# EAGLE design Relay-Timer (EAGLE 6.3)

## Sheet 1 of 5
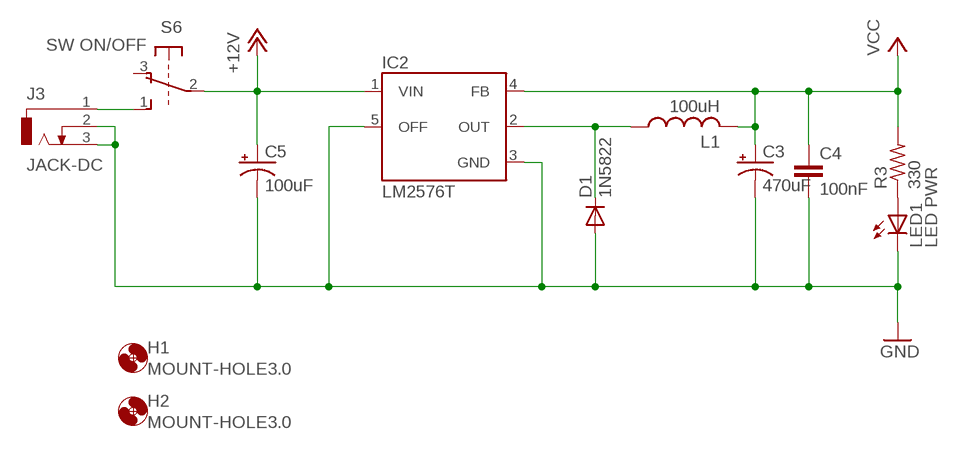
[diagram p0: schematic, sheet 1]

### Parts
C3  470uF  CAPACITOR-POLARE3.5-8  [E3,5-8]
C4  100nF  CAPACITOR-NONPOLAR025-024X044  [C025-024X044]
C5  100uF  CAPACITOR-POLARE2.5-6  [E2,5-6]
D1  1N5822  DIODE-1N5822  [DO201-15]
H1  MOUNT-HOLE3.0  [3,0]
H2  MOUNT-HOLE3.0  [3,0]
IC2  LM2576T  [TO220-5]
J3  JACK-DC  [DCJ0202]
L1  100uH  INDUCTORTJ3-U2  [TJ3-U2]
LED1  LED PWR  LED3MM  [LED3MM]
R3  330  RESISTOR0204/7  [0204/7]
S6  SW ON/OFF  SWITCH-DETENT  [9077-2]

### Nets
+12V [pwr]: C5.+ IC2.1(VIN) S6.2(P) ; also sheet 4
GND [vcc]: C3.- C4.2 C5.- D1.A IC2.3(GND) IC2.5(OFF) J3.2 J3.3 LED1.K(C) ; also sheet 2,3,4,5
N$5: D1.C IC2.2(OUT) L1.1
N$6: LED1.A R3.1
N$37 [pwr]: J3.1 S6.1(S)
VCC [vcc]: C3.+ C4.1 IC2.4(FB) L1.2 R3.2 ; also sheet 2,5
Unconnected: S6.3(O)

## Sheet 2 of 5
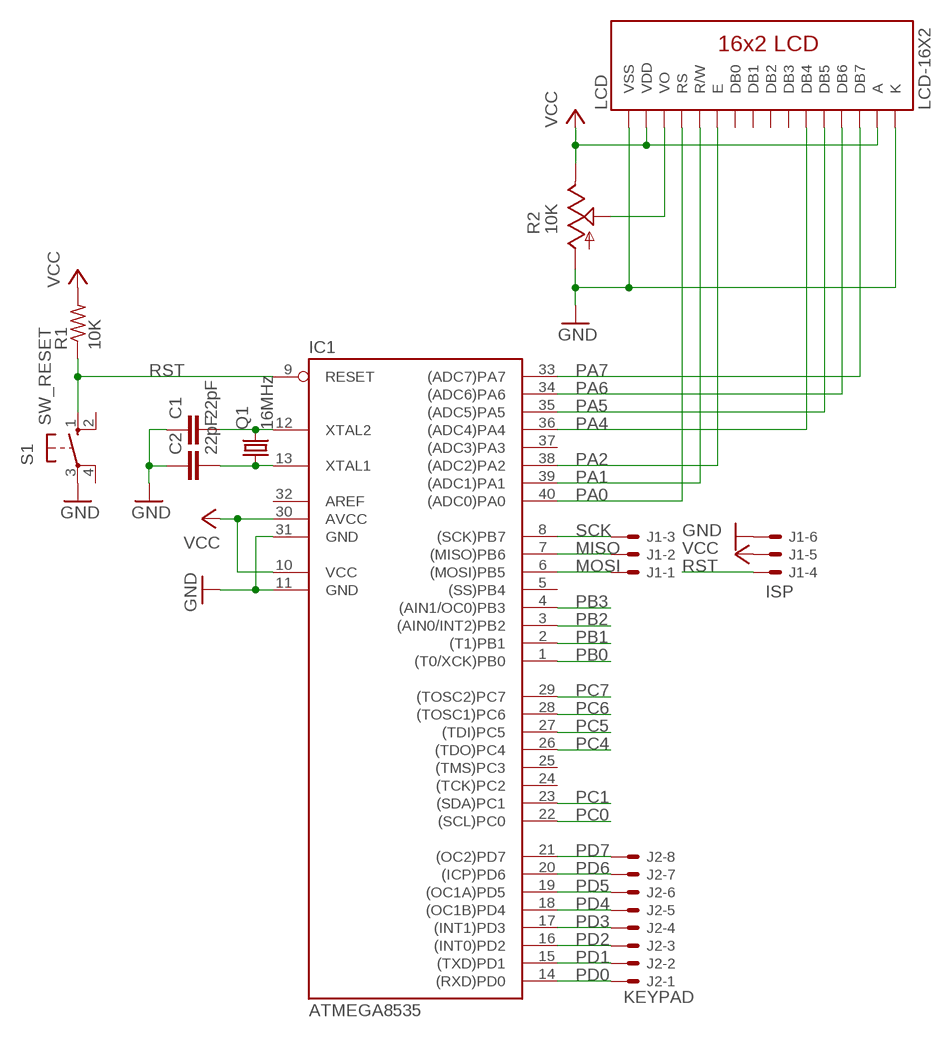
[diagram p1: schematic, sheet 2]

### Parts
C1  22pF  CAPACITOR-NONPOLAR025-024X044  [C025-024X044]
C2  22pF  CAPACITOR-NONPOLAR025-024X044  [C025-024X044]
IC1  ATMEGA8535  ATMEGA8535/16/32  [DIL40]
J1  ISP  CON_MOLEX-27-2061-06  [6410-06]
J2  KEYPAD  CON_MOLEX-27-2081-08  [6410-08]
LCD  LCD-16X2  [LCD-16X2]
Q1  16MHz  CRYSTALHC49S  [HC49/S]
R1  10K  RESISTOR0204/7  [0204/7]
R2  10K  TRIMPOTCA6V  [CA6V]
S1  SW_RESET  SW-PUSHBUTTON  [B3F-10XX]

### Nets
GND [vcc]: C1.1 C2.1 IC1.11(GND) IC1.31(GND) J1.6 LCD.1(VSS) LCD.16(K) R2.A S1.3(P) ; also sheet 1,3,4,5
MISO: IC1.7((MISO)PB6) J1.2
MOSI: IC1.6((MOSI)PB5) J1.1
N$2: C1.2 IC1.12(XTAL2) Q1.2
N$3: C2.2 IC1.13(XTAL1) Q1.1
N$4: LCD.3(VO) R2.S
PA0: IC1.40((ADC0)PA0) LCD.4(RS)
PA1: IC1.39((ADC1)PA1) LCD.5(R/W)
PA2: IC1.38((ADC2)PA2) LCD.6(E)
PA4: IC1.36((ADC4)PA4) LCD.11(DB4)
PA5: IC1.35((ADC5)PA5) LCD.12(DB5)
PA6: IC1.34((ADC6)PA6) LCD.13(DB6)
PA7: IC1.33((ADC7)PA7) LCD.14(DB7)
PB0: IC1.1((T0/XCK)PB0) ; also sheet 3
PB1: IC1.2((T1)PB1) ; also sheet 3
PB2: IC1.3((AIN0/INT2)PB2) ; also sheet 3
PB3: IC1.4((AIN1/OC0)PB3) ; also sheet 3
PC0: IC1.22((SCL)PC0) ; also sheet 5
PC1: IC1.23((SDA)PC1) ; also sheet 5
PC4: IC1.26((TDO)PC4) ; also sheet 4
PC5: IC1.27((TDI)PC5) ; also sheet 4
PC6: IC1.28((TOSC1)PC6) ; also sheet 4
PC7: IC1.29((TOSC2)PC7) ; also sheet 4
PD0: IC1.14((RXD)PD0) J2.1
PD1: IC1.15((TXD)PD1) J2.2
PD2: IC1.16((INT0)PD2) J2.3
PD3: IC1.17((INT1)PD3) J2.4
PD4: IC1.18((OC1B)PD4) J2.5
PD5: IC1.19((OC1A)PD5) J2.6
PD6: IC1.20((ICP)PD6) J2.7
PD7: IC1.21((OC2)PD7) J2.8
RST: IC1.9(RESET) J1.4 R1.1 S1.1(S)
SCK: IC1.8((SCK)PB7) J1.3
VCC [vcc]: IC1.10(VCC) IC1.30(AVCC) J1.5 LCD.2(VDD) LCD.15(A) R1.2 R2.E ; also sheet 1,5
Unconnected: IC1.5((SS)PB4) IC1.24((TCK)PC2) IC1.25((TMS)PC3) IC1.32(AREF) IC1.37((ADC3)PA3) LCD.7(DB0) LCD.8(DB1) LCD.9(DB2) LCD.10(DB3) S1.2(S1) S1.4(P1)

## Sheet 3 of 5
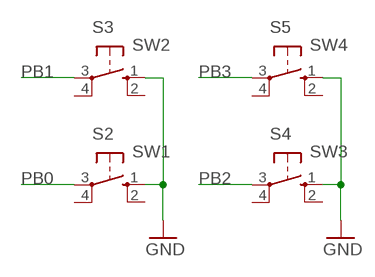
[diagram p2: schematic, sheet 3]

### Parts
S2  SW1  SW-PUSHBUTTON  [B3F-10XX]
S3  SW2  SW-PUSHBUTTON  [B3F-10XX]
S4  SW3  SW-PUSHBUTTON  [B3F-10XX]
S5  SW4  SW-PUSHBUTTON  [B3F-10XX]

### Nets
GND [vcc]: S2.1(S) S3.1(S) S4.1(S) S5.1(S) ; also sheet 1,2,4,5
PB0: S2.3(P) ; also sheet 2
PB1: S3.3(P) ; also sheet 2
PB2: S4.3(P) ; also sheet 2
PB3: S5.3(P) ; also sheet 2
Unconnected: S2.2(S1) S2.4(P1) S3.2(S1) S3.4(P1) S4.2(S1) S4.4(P1) S5.2(S1) S5.4(P1)

## Sheet 4 of 5
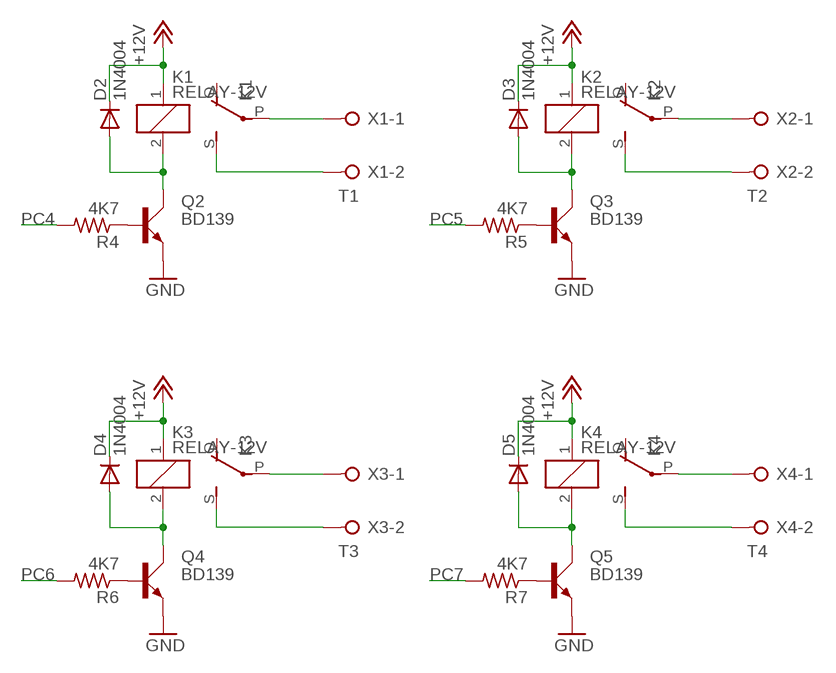
[diagram p3: schematic, sheet 4]

### Parts
D2  1N4004  DIODE-1N4004  [DO41-10]
D3  1N4004  DIODE-1N4004  [DO41-10]
D4  1N4004  DIODE-1N4004  [DO41-10]
D5  1N4004  DIODE-1N4004  [DO41-10]
K1  RELAY-12V  G5L  [G5LE]
K2  RELAY-12V  G5L  [G5LE]
K3  RELAY-12V  G5L  [G5LE]
K4  RELAY-12V  G5L  [G5LE]
Q2  BD139  [TO126AV]
Q3  BD139  [TO126AV]
Q4  BD139  [TO126AV]
Q5  BD139  [TO126AV]
R4  4K7  RESISTOR0204/7  [0204/7]
R5  4K7  RESISTOR0204/7  [0204/7]
R6  4K7  RESISTOR0204/7  [0204/7]
R7  4K7  RESISTOR0204/7  [0204/7]
X1  T1  W237-02P  [W237-132]
X2  T2  W237-02P  [W237-132]
X3  T3  W237-02P  [W237-132]
X4  T4  W237-02P  [W237-132]

### Nets
+12V [pwr]: D2.C D3.C D4.C D5.C K1.1 K2.1 K3.1 K4.1 ; also sheet 1
GND [vcc]: Q2.E Q3.E Q4.E Q5.E ; also sheet 1,2,3,5
N$1: D2.A K1.2 Q2.C
N$7: Q2.B R4.1
N$10 [pwr]: K1.P(2:P) X1.1
N$11 [pwr]: K1.S(2:S) X1.2
N$12: D3.A K2.2 Q3.C
N$13: Q3.B R5.1
N$14 [pwr]: K2.P(2:P) X2.1
N$15 [pwr]: K2.S(2:S) X2.2
N$16: D4.A K3.2 Q4.C
N$17: Q4.B R6.1
N$18 [pwr]: K3.P(2:P) X3.1
N$19 [pwr]: K3.S(2:S) X3.2
N$20: D5.A K4.2 Q5.C
N$21: Q5.B R7.1
N$25 [pwr]: K4.P(2:P) X4.1
N$26 [pwr]: K4.S(2:S) X4.2
PC4: R4.2 ; also sheet 2
PC5: R5.2 ; also sheet 2
PC6: R6.2 ; also sheet 2
PC7: R7.2 ; also sheet 2
Unconnected: K1.O(2:O) K2.O(2:O) K3.O(2:O) K4.O(2:O)

## Sheet 5 of 5
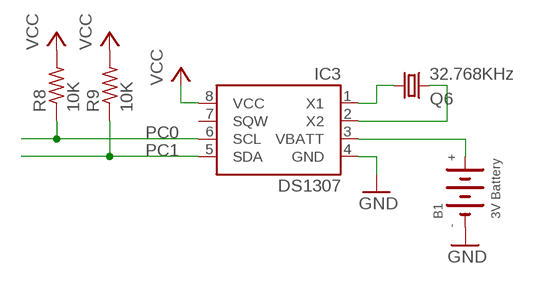
[diagram p4: schematic, sheet 5]

### Parts
B1  3V Battery  BATTERYCR2032  [CR2032]
IC3  DS1307  [DIP08]
Q6  32.768KHz  CRYSTALTC26H  [TC26H]
R8  10K  RESISTOR0204/7  [0204/7]
R9  10K  RESISTOR0204/7  [0204/7]

### Nets
GND [vcc]: B1.- IC3.4(GND) ; also sheet 1,2,3,4
N$29: IC3.1(X1) Q6.1
N$30: IC3.2(X2) Q6.2
N$31: B1.+ IC3.3(VBATT)
PC0: IC3.6(SCL) R8.1 ; also sheet 2
PC1: IC3.5(SDA) R9.1 ; also sheet 2
VCC [vcc]: IC3.8(VCC) R8.2 R9.2 ; also sheet 1,2
Unconnected: IC3.7(SQW)

## Library data of the parts
B1 = microbuilder:BATTERY
C1 C2 C4 = barelang-store:CAPACITOR-NONPOLAR: CAPACITOR, European symbol
C3 C5 = barelang-store:CAPACITOR-POLAR: POLARIZED CAPACITOR, American symbol
D1 = barelang-store:DIODE-1N5822: DIODE standard rectifier, 3 A, 50 V (Motorola)
D2-D5 = barelang-store:DIODE-1N4004: DIODE general purpose rectifier, 1 A
H1 H2 = holes:MOUNT-HOLE: MOUNTING HOLE with drill center marker
IC1 = barelang-store:ATMEGA8535/16/32: MICROCONTROLLER 32 Kbytes FLASH 2 Kbytes SRAM 1 Kbytes EEPROM USART 8-channel 10 bit ADC Source: www.atmel.com .. doc2503.pdf; MPN: ATMEGA32-16PU; OC_FARNELL: 1661729; OC_NEWARK: 51P1794
IC2 = barelang-store:LM2576: National Semiconductor <http://www.national.com> 3.0A "Simple Switcher"(c) 52kHz, Vout 1.23-37V (HV: 57V), Vin 40V (HV: 60V), 50µA standby current
IC3 = barelang-store:DS1307
J1 = barelang-store:CON_MOLEX-?-06: CONNECTOR wire to board 2.54 mm (.1 inch) pitch header; OC_FARNELL: unknown; OC_NEWARK: unknown
J2 = barelang-store:CON_MOLEX-?-08: CONNECTOR wire to board 2.54 mm (.1 inch) pitch header; OC_FARNELL: unknown; OC_NEWARK: unknown
J3 = barelang-store:JACK-DC: DC POWER JACK Source: DCJ0202.pdf; OC_FARNELL: unknown; OC_NEWARK: unknown
K1-K4 = relay:G5L: RELAY 1 x switch, 10 A/120 V AC, 8 A/30 V ADC, Omron; OC_FARNELL: unknown; OC_NEWARK: unknown
L1 = barelang-store:INDUCTOR: INDUCTOR, American symbol
LCD = barelang-store:LCD-16X2
LED1 = barelang-store:LED: LED OSRAM: - CHIPLED LG R971, LG N971, LY N971, LG Q971, LY Q971, LO R971, LY R971 LH N974, LH R974 LS Q976, LO Q976, LY Q976 LO Q996 - Hyper CHIPLED LW Q18S LB Q993, LB Q99A, LB R99A - SideLED LS A670, LO A670, LY A670, LG A670, LP A670 LB A673, LV A673, LT A673, LW A673 LH A674 LY A675 LS A676, LA A676, LO A676, LY A676, LW A676 LS A679, LY A679, LG A679 - Hyper Micro SIDELED® LS Y876, LA Y876, LO Y876, LY Y876 LT Y87S - SmartLED LW L88C, LW L88S LB L89C, LB L89S, LG L890 LS L89K, LO L89K, LY L89K LS L896, LA L896, LO L896, LY L896 - TOPLED LS T670, LO T670, LY T670, LG T670, LP T670 LSG T670, LSP T670, LSY T670, LOP T670, LYG T670 LG T671, LOG T671, LSG T671 LB T673, LV T673, LT T673, LW T673 LH T674 LS T676, LA T676, LO T676, LY T676, LB T676, LH T676, LSB T676, LW T676 LB T67C, LV T67C, LT T67C, LS T67K, LO T67K, LY T67K, LW E67C LS E67B, LA E67B, LO E67B, LY E67B, LB E67C, LV E67C, LT E67C LW T67C LS T679, LY T679, LG T679 LS T770, LO T770, LY T770, LG T770, LP T770 LB T773, LV T773, LT T773, LW T773 LH T774 LS E675, LA E675, LY E675, LS T675 LS T776, LA T776, LO T776, LY T776, LB T776 LHGB T686 LT T68C, LB T68C - Hyper Mini TOPLED® LB M676 - Mini TOPLED Santana® LG M470 LS M47K, LO M47K, LY M47K Source: http://www.osram.convergy.de LUXEON: - LUMILED® LXK2-PW12-R00, LXK2-PW12-S00, LXK2-PW14-U00, LXK2-PW14-V00 LXK2-PM12-R00, LXK2-PM12-S00, LXK2-PM14-U00 LXK2-PE12-Q00, LXK2-PE12-R00, LXK2-PE12-S00, LXK2-PE14-T00, LXK2-PE14-U00 LXK2-PB12-K00, LXK2-PB12-L00, LXK2-PB12-M00, LXK2-PB14-N00, LXK2-PB14-P00, LXK2-PB14-Q00 LXK2-PR12-L00, LXK2-PR12-M00, LXK2-PR14-Q00, LXK2-PR14-R00 LXK2-PD12-Q00, LXK2-PD12-R00, LXK2-PD12-S00 LXK2-PH12-R00, LXK2-PH12-S00 LXK2-PL12-P00, LXK2-PL12-Q00, LXK2-PL12-R00 Source: www.luxeon.com KINGBRIGHT: KA-3528ASYC Source: www.kingbright.com
Q1 = barelang-store:CRYSTAL: CRYSTAL; OC_FARNELL: 1667008; OC_NEWARK: unknown
Q2-Q5 = barelang-store:BD139: NPN TRANSISTOR
Q6 = crystal:CRYSTAL: CRYSTAL; OC_FARNELL: unknown; OC_NEWARK: unknown
R1 R3-R9 = barelang-store:RESISTOR: RESISTOR, American symbol
R2 = barelang-store:TRIMPOT: POTENTIOMETER
S1-S5 = barelang-store:SW-PUSHBUTTON: OMRON SWITCH; MPN: B3F-1000; OC_FARNELL: 176432; OC_NEWARK: 36M3542
S6 = barelang-store:SWITCH-DETENT: MARQUARDT SWITCH 9077.0200 Distributor: Buerklin <https://www.buerklin.com/default.asp?event=ShowArtikel%2812G2822%29&l=d&jump=ArtNr_12G2822>
X1-X4 = barelang-store:W237-02P: WAGO SREW CLAMP; OC_FARNELL: unknown; OC_NEWARK: unknown

## Net classes
0 default: width 0.4 mm
1 pwr: width 0.7 mm
2 vcc: width 0.5 mm

## Board
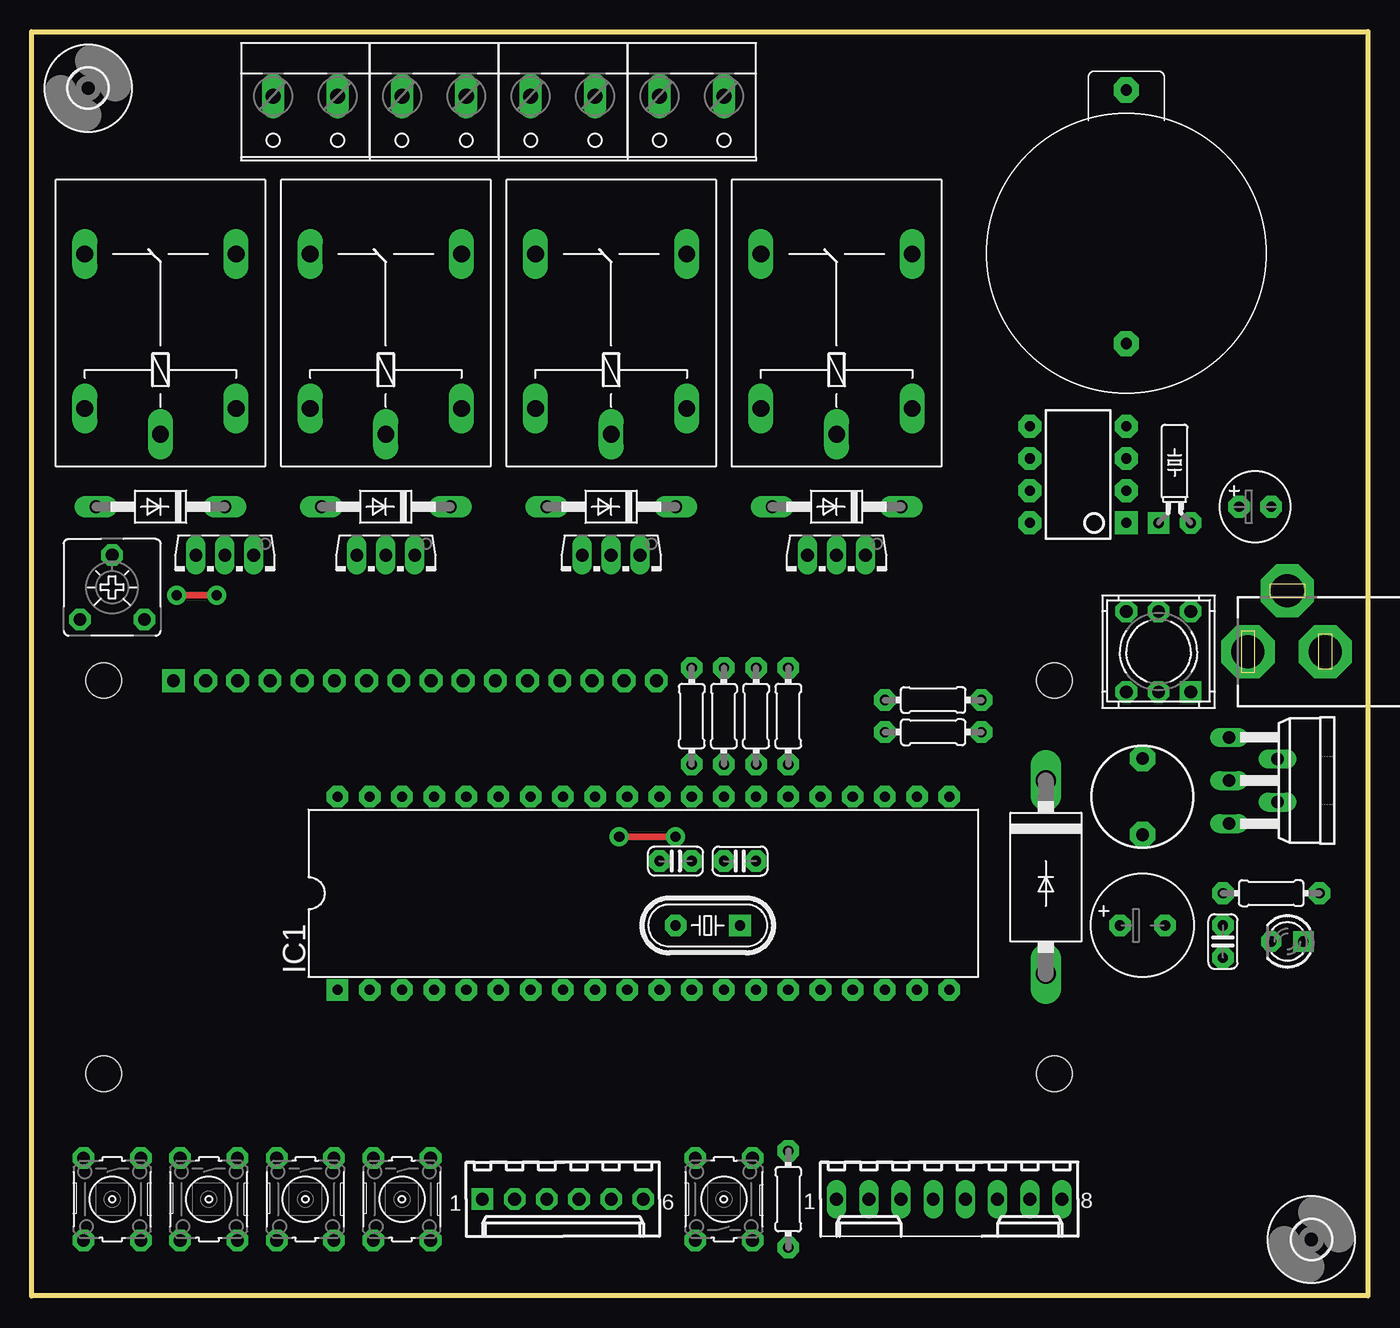
[diagram p5: board, top side]
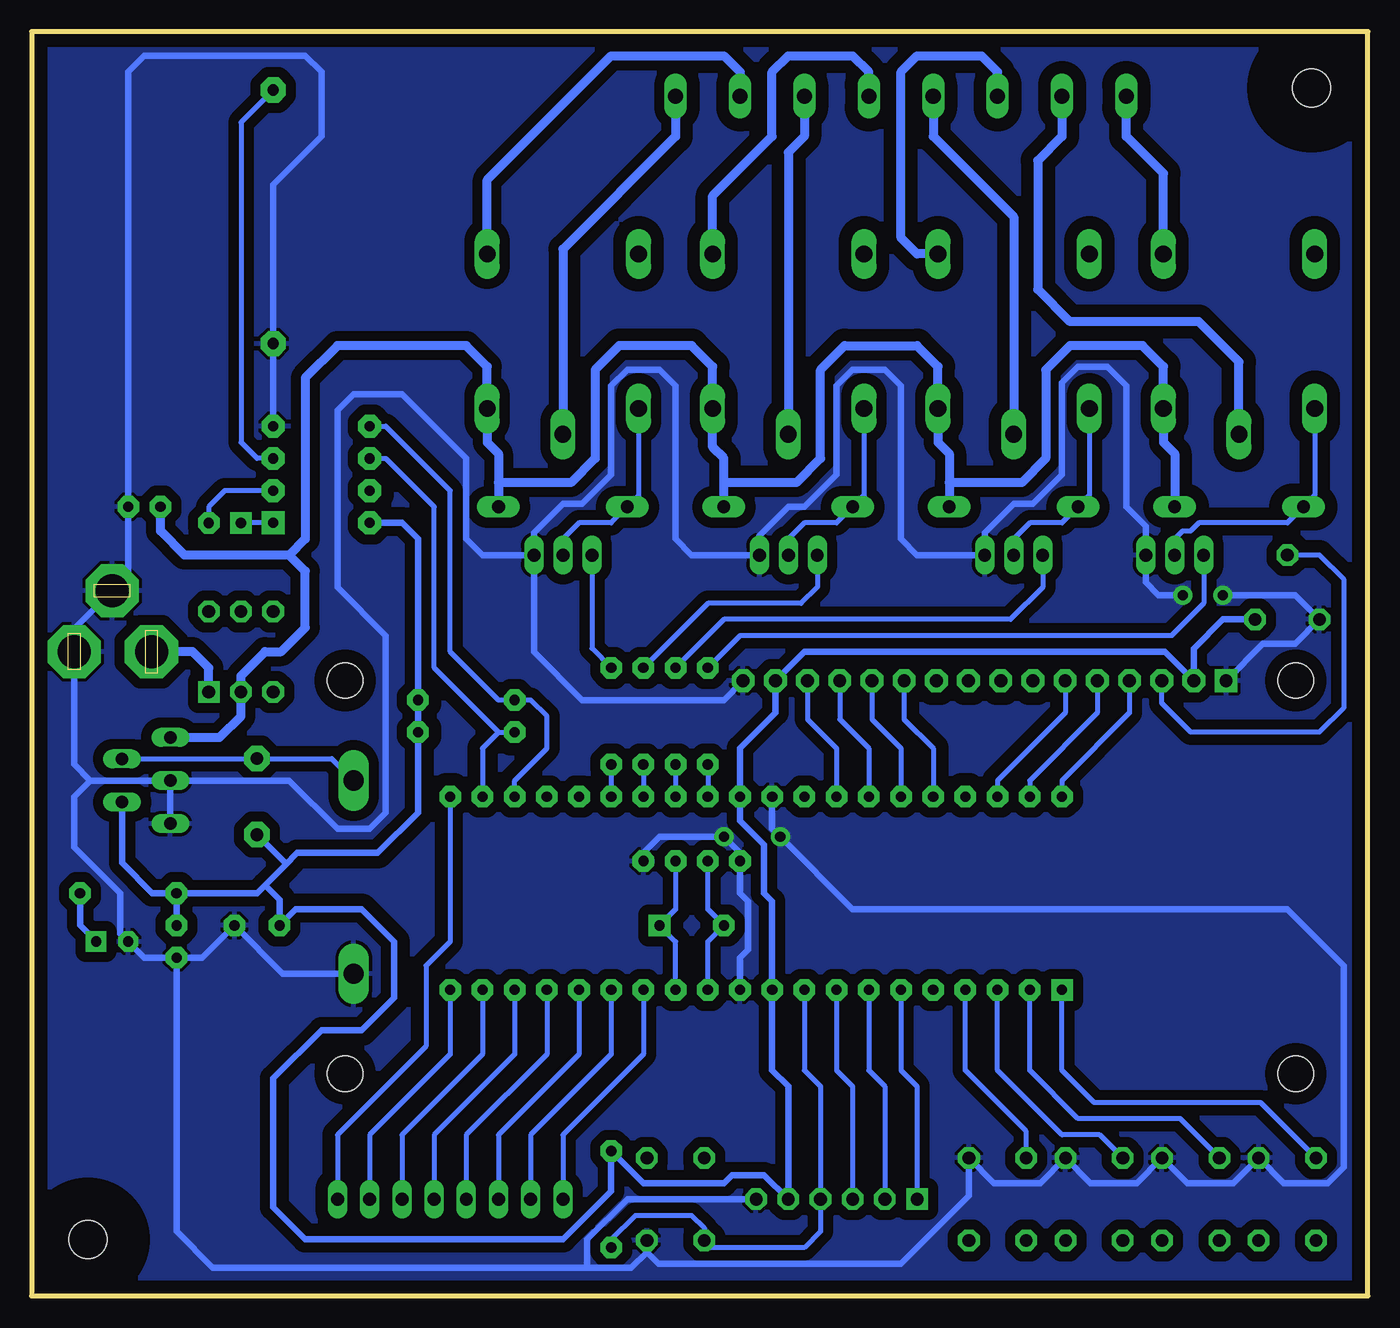
[diagram p6: board, bottom side, seen from below]

Size 105.41 x 99.69 mm. Coordinates in mm from the lower left corner, seen from the top.
Outline: 0,99.69 105.41,99.69 105.41,0 0,0 0,99.69
Copper layers (1*16): Top 0.035mm / dielectric 1.5mm / Bottom 0.035mm
Design rules "default": minimum track width 10mil, minimum drill 24mil, track to track 8mil, track to pad 8mil, pad to pad 8mil, via to via 8mil, smd to smd 8mil, copper to edge 40mil, drill to drill 8mil, minimum pad ring 10mil, minimum via ring 8mil, stop-mask expansion 4mil, vias tented up to drill 0mil, thermal gap 10mil

### Footprints (pad centres in the part's own frame; a part is rotated, then mirrored left to right if it is on the bottom)
CR2032 = drill 0.9 pad 2 octagon: + 10,0; - -10,0
C025-024X044 = drill 0.8 pad 1.7 octagon: 1 -1.27,0; 2 1.27,0
E3,5-8 = drill 0.813 pad 1.7 octagon: + -1.778,0; - 1.778,0
E2,5-6 = drill 0.8 pad 1.7 octagon: + -1.27,0; - 1.27,0
DO201-15 = drill 1.6 long: A 7.62,0; C -7.62,0
DO41-10 = drill 1 pad 1.7 long: A 5.08,0; C -5.08,0
3,0 = hole 3: 0,0
DIL40 = drill 0.8 pad 1.7 square: 1 -24.13,-7.62 | drill 0.8 pad 1.7 octagon: 2 -21.59,-7.62; 3 -19.05,-7.62; 4 -16.51,-7.62; 5 -13.97,-7.62; 6 -11.43,-7.62; 7 -8.89,-7.62; 8 -6.35,-7.62; 9 -3.81,-7.62; 10 -1.27,-7.62; 11 1.27,-7.62; 12 3.81,-7.62; 13 6.35,-7.62; 14 8.89,-7.62; 15 11.43,-7.62; 16 13.97,-7.62; 17 16.51,-7.62; 18 19.05,-7.62; 19 21.59,-7.62; 20 24.13,-7.62; 21 24.13,7.62; 22 21.59,7.62; 23 19.05,7.62; 24 16.51,7.62; 25 13.97,7.62; 26 11.43,7.62; 27 8.89,7.62; 28 6.35,7.62; 29 3.81,7.62; 30 1.27,7.62; 31 -1.27,7.62; 32 -3.81,7.62; 33 -6.35,7.62; 34 -8.89,7.62; 35 -11.43,7.62; 36 -13.97,7.62; 37 -16.51,7.62; 38 -19.05,7.62; 39 -21.59,7.62; 40 -24.13,7.62
TO220-5 = drill 1 long: 1 -3.4,-8.4; 2 -1.7,-4.59; 3 0,-8.4; 4 1.7,-4.59; 5 3.4,-8.4
DIP08 = drill 0.8 pad 1.8 square: 1 -3.81,-3.81 | drill 0.8 pad 1.8 octagon: 2 -1.27,-3.81; 3 1.27,-3.81; 4 3.81,-3.81; 5 3.81,3.81; 6 1.27,3.81; 7 -1.27,3.81; 8 -3.81,3.81
6410-06 = drill 1 pad 1.7 square: 1 6.35,0 | drill 1 pad 1.7 octagon: 2 3.81,0; 3 1.27,0; 4 -1.27,0; 5 -3.81,0; 6 -6.35,0
6410-08 = drill 1.016 long: 1 8.89,0; 2 6.35,0; 3 3.81,0; 4 1.27,0; 5 -1.27,0; 6 -3.81,0; 7 -6.35,0; 8 -8.89,0
DCJ0202 = drill 2.6 pad 4.2 octagon: 1 0,3.1; 2 4.8,0; 3 0,-3
G5LE = drill 1.321 long: 1 -7.493,-5.969; 2 -7.493,5.969; O 4.699,5.969; P -9.525,0; S 4.699,-5.969
TJ3-U2 = drill 1 pad 2 octagon: 1 -3,0; 2 3,0
LCD-16X2 = drill 1.016 pad 1.8 square: 1 -32,15.5 | drill 1.016 pad 1.8 octagon: 2 -29.46,15.5; 3 -26.92,15.5; 4 -24.38,15.5; 5 -21.84,15.5; 6 -19.3,15.5; 7 -16.76,15.5; 8 -14.22,15.5; 9 -11.68,15.5; 10 -9.14,15.5; 11 -6.6,15.5; 12 -4.06,15.5; 13 -1.52,15.5; 14 1.02,15.5; 15 3.56,15.5; 16 6.1,15.5 | hole 2.8: -37.5,15.5; -37.5,-15.5; 37.5,15.5; 37.5,-15.5
LED3MM = drill 0.8 pad 1.6 square: A -1.27,0 | drill 0.8 pad 1.6 octagon: K 1.27,0
HC49/S = drill 0.8 pad 1.7 square: 1 -2.54,0 | drill 0.8 pad 1.7 octagon: 2 2.54,0
TO126AV = drill 1.016 long: B 2.286,-1.27; C 0,-1.27; E -2.286,-1.27
TC26H = drill 0.813 pad 1.7 square: 1 -1.27,0 | drill 0.813 pad 1.7 octagon: 2 1.27,0
0204/7 = drill 0.813 pad 1.7 octagon: 1 -3.81,0; 2 3.81,0
CA6V = drill 1 pad 1.7 octagon: A -2.54,-2.54; E 2.54,-2.54; S 0,2.54
B3F-10XX = drill 1 pad 1.7 octagon: 1 -3.251,2.261; 2 3.251,2.261; 3 -3.251,-2.261; 4 3.251,-2.261
9077-2 = drill 1 pad 1.7 square: 1 -2.54,3.175 | drill 1 pad 1.7 octagon: 2 0,3.175; 3 2.54,3.175; 4 -2.54,-3.175; 5 0,-3.175; 6 2.54,-3.175
W237-132 = drill 1.194 long: 1 -2.54,-0.635; 2 2.54,-0.635

### Placement (x,y rotation side)
B1  86.36,85.09 90 top
C1  50.8,34.29 0 top
C2  55.88,34.29 180 top
C3  87.63,29.21 0 top
C4  93.98,27.94 270 top
C5  96.52,62.23 0 top
D1  80.01,33.02 270 top
D2  63.5,62.23 180 top
D3  45.72,62.23 180 top
D4  27.94,62.23 180 top
D5  10.16,62.23 180 top
H1  4.45,95.25 0 top
H2  100.97,4.44 0 top
IC1  48.26,31.75 0 top
IC2  102.87,40.64 270 top
IC3  82.55,64.77 90 top
J1  41.91,7.62 180 top
J2  72.39,7.62 180 top
J3  99.06,50.8 90 top
K1  63.5,77.47 90 top
K2  45.72,77.47 90 top
K3  27.94,77.47 90 top
K4  10.16,77.47 90 top
L1  87.63,39.37 270 top
LCD  43.18,33.02 0 top
LED1  99.06,27.94 180 top
Q1  53.34,29.21 180 top
Q2  63.5,57.15 180 top
Q3  45.72,57.15 180 top
Q4  27.94,57.15 180 top
Q5  15.24,57.15 180 top
Q6  90.17,60.96 0 top
R1  59.69,7.62 90 top
R2  6.35,55.88 0 top
R3  97.79,31.75 180 top
R4  59.69,45.72 270 top
R5  57.15,45.72 270 top
R6  54.61,45.72 270 top
R7  52.07,45.72 270 top
R8  71.12,44.45 0 top
R9  71.12,46.99 0 top
S1  54.61,7.62 90 top
S2  6.35,7.62 270 top
S3  13.97,7.62 270 top
S4  21.59,7.62 270 top
S5  29.21,7.62 270 top
S6  88.9,50.8 180 top
X1  52.07,93.98 180 top
X2  41.91,93.98 180 top
X3  31.75,93.98 180 top
X4  21.59,93.98 180 top

### Tracks (layer width: path | path; a pad name or v marks a point on that pad's centre or on a via)
+12V
  Bottom 0.7: 68.58,64.14 62.86,64.14 60.96,66.04 60.96,73.02 59.05,74.93 53.34,74.93 51.69,73.28 K2.1 51.69,66.93 50.8,66.04 50.8,64.14 | 68.58,64.14 68.58,66.42 69.47,67.31 K1.1 69.47,73.28 71.12,74.93 81.28,74.93 83.82,72.39 83.82,59.69 85.09,58.42 | 33.02,64.14 27.31,64.14 25.4,66.04 25.4,73.02 23.5,74.93 17.78,74.93 16.13,73.28 K4.1 16.13,67.31 15.24,66.42 D5.C | 33.02,64.14 33.02,66.42 33.91,67.31 K3.1 33.91,73.28 35.56,74.93 41.28,74.93 43.18,73.02 43.18,66.04 45.08,64.14 50.8,64.14 | 33.02,64.14 D4.C | 85.09,58.42 83.82,57.15 83.82,52.7 85.72,50.8 86.99,50.8 88.9,48.89 S6.2 88.9,45.72 90.58,44.04 IC2.1 | 85.09,58.42 93.34,58.42 95.25,60.33 C5.+ | 68.58,64.14 D2.C | D3.C 50.8,64.14
GND  (via drill 0.8 pad 1.5)
  Top 0.5: v50.8,36.2 v46.35,36.2 | v14.61,55.25 v11.43,55.25
  Bottom 0.5: IC2.3 85.09,40.64 81.28,36.83 78.74,36.83 77.47,38.1 77.47,52.07 81.28,55.88 81.28,69.85 80.01,71.12 76.2,71.12 71.12,66.04 71.12,59.69 69.85,58.42 Q2.E | LCD.16 50.81,46.99 61.98,46.99 65.79,50.8 Q2.E | C4.2 93.98,5.08 91.12,2.22 61.59,2.22 | J1.6 58.42,7.62 61.59,4.44 61.59,2.22 | LCD.1 8.27,51.44 5.71,51.44 R2.A 5.71,55.25 v11.43,55.25 | C4.2 91.95,26.67 C3.- 85.6,25.4 D1.A | C4.2 96.52,26.67 LED1.K 98.42,28.57 98.42,31.75 102.06,35.38 102.06,39.37 100.79,40.64 | IC1.11 49.53,26.67 48.89,27.3 48.89,31.11 49.53,31.75 C1.1 49.53,34.92 v50.8,36.2 55.88,36.2 57.15,34.92 C2.1 | IC3.4 B1.- 86.36,87.63 82.55,91.44 82.55,96.52 83.82,97.79 96.52,97.79 97.79,96.52 C5.- 97.79,56.87 J3.2 102.06,52.6 J3.3 102.06,41.91 100.79,40.64 | Q2.E 65.79,60.19 63.5,62.48 61.98,62.48 59.69,64.77 59.69,71.75 58.42,73.02 55.88,73.02 54.61,71.75 54.61,59.69 53.34,58.42 Q3.E 48.01,59.94 45.72,62.23 44.45,62.23 41.91,64.77 41.91,71.75 40.64,73.02 38.1,73.02 36.83,71.75 36.83,59.69 35.56,58.42 Q4.E 30.23,60.19 27.94,62.48 26.42,62.48 24.13,64.77 24.13,72 22.86,73.27 20.56,73.27 19.05,71.75 19.05,62.23 17.53,60.71 Q5.E 17.53,56.26 16.51,55.25 v14.61,55.25 | 56.87,3.45 58.11,2.22 61.59,2.22 | 56.87,3.45 S1.3 | 56.87,3.45 55.96,2.54 36.83,2.54 31.47,7.9 S5.1 29.49,8.89 25.83,8.89 S4.1 21.87,8.89 18.21,8.89 S3.1 14.25,8.89 10.59,8.89 S2.1 6.63,8.89 3.18,8.89 1.91,10.16 1.91,26.03 6.35,30.48 40.64,30.48 v46.35,36.2 46.99,36.83 IC1.31 | IC2.5 IC2.3 | IC2.3 100.79,40.64
  pour Bottom (isolate 0.8): 0,99.69 105.41,99.69 105.41,0 0,0
MISO
  Bottom 0.4: IC1.7 39.37,17.78 38.1,16.51 J1.2
MOSI
  Bottom 0.4: IC1.6 36.83,17.78 35.56,16.51 J1.1
N$1
  Bottom 0.4: K1.2 57.53,63.12 D2.A 59.69,60.96 62.23,60.96 63.5,59.69 Q2.C
N$2
  Bottom 0.4: C1.2 52.07,30.48 Q1.2 52.07,27.94 IC1.12
N$3
  Bottom 0.4: C2.2 54.61,30.48 Q1.1 54.61,27.94 IC1.13
N$4
  Bottom 0.4: LCD.3 16.26,46.74 13.97,44.45 3.81,44.45 1.91,46.36 1.91,56.52 3.81,58.42 R2.S
N$5
  Bottom 0.4: IC2.2 87.66,42.34 L1.1 81.74,42.37 D1.C
N$6
  Bottom 0.5: LED1.A 101.6,29.21 R3.1
N$7
  Bottom 0.4: Q2.B 61.21,51.05 R4.1
N$8
  pour Bottom (isolate 1): 0,99.69 105.41,99.69 105.41,0 0,0
N$10
  Bottom 0.7: X1.1 54.61,91.44 63.5,82.55 K1.P
N$11
  Bottom 0.7: K1.S 69.47,88.01 59.69,97.79 50.8,97.79 49.53,96.52 X1.2
N$12
  Bottom 0.4: K2.2 39.75,63.12 D3.A 41.91,60.96 44.45,60.96 45.72,59.69 Q3.C
N$13
  Bottom 0.4: Q3.B 43.43,55.88 44.7,54.61 52.07,54.61 R5.1
N$14
  Bottom 0.7: X2.1 44.45,91.44 45.72,90.17 K2.P
N$15
  Bottom 0.7: K2.S 51.69,86.74 46.99,91.44 46.99,96.52 45.72,97.79 40.64,97.79 39.37,96.52 X2.2
N$16
  Bottom 0.4: K3.2 21.97,63.12 D4.A 24.13,60.96 26.67,60.96 27.94,59.69 Q4.C
N$17
  Bottom 0.4: Q4.B 25.65,55.88 28.19,53.34 50.8,53.34 R6.1
N$18
  Bottom 0.7: X3.1 34.29,91.44 27.94,85.09 K3.P
N$19
  Bottom 0.7: K3.S 35.56,82.17 36.83,83.44 36.83,96.52 35.56,97.79 30.48,97.79 29.21,96.52 X3.2
N$20
  Bottom 0.4: Q5.C 15.24,59.69 14.61,60.33 13.97,60.33 13.33,60.96 6.35,60.96 D5.A 4.19,63.12 K4.2
N$21
  Bottom 0.4: Q5.B 12.95,54.61 15.49,52.07 49.53,52.07 R7.1
N$25
  Bottom 0.7: K4.P 10.16,73.66 13.33,76.83 23.5,76.83 26.04,79.38 26.04,89.53 24.13,91.44 X4.1
N$26
  Bottom 0.7: K4.S 16.13,88.52 19.05,91.44 X4.2
N$29
  Bottom 0.4: IC3.1 Q6.1
N$30
  Bottom 0.4: IC3.2 90.17,63.5 91.44,62.23 Q6.2
N$31
  Bottom 0.4: B1.+ 88.9,92.55 88.9,67.31 87.63,66.04 IC3.3
N$37
  Bottom 0.7: S6.1 91.44,49.53 92.71,50.8 J3.1
PA0
  Bottom 0.4: LCD.4 18.8,45.97 24.13,40.64 IC1.40
PA1
  Bottom 0.4: LCD.5 21.34,45.97 26.67,40.64 IC1.39
PA2
  Bottom 0.4: LCD.6 23.88,45.97 29.21,40.64 IC1.38
PA4
  Bottom 0.4: LCD.11 36.58,45.47 34.29,43.18 IC1.36
PA5
  Bottom 0.4: LCD.12 39.12,45.47 36.83,43.18 IC1.35
PA6
  Bottom 0.4: LCD.13 41.66,45.47 39.37,43.18 IC1.34
PA7
  Bottom 0.4: LCD.14 44.2,45.47 41.91,43.18 IC1.33
PB0
  Bottom 0.4: S2.3 8.46,15.24 21.59,15.24 24.13,17.78 IC1.1
PB1
  Bottom 0.4: S3.3 14.81,13.97 22.86,13.97 26.67,17.78 IC1.2
PB2
  Bottom 0.4: S4.3 21.16,12.7 24.13,12.7 29.21,17.78 IC1.3
PB3
  Bottom 0.4: S5.3 26.95,12.98 31.75,17.78 IC1.4
PC0
  Bottom 0.4: IC1.22 69.85,43.18 68.58,44.45 | 68.58,44.45 R8.1 | 68.58,44.45 73.66,49.53 73.66,62.23 77.47,66.04 IC3.6
PC1
  Bottom 0.4: IC1.23 67.31,40.64 64.77,43.18 64.77,45.72 66.04,46.99 R9.1 68.58,46.99 72.39,50.8 72.39,63.5 77.47,68.58 IC3.5
PC4
  Bottom 0.4: R4.2 IC1.26
PC5
  Bottom 0.4: R5.2 IC1.27
PC6
  Bottom 0.4: R6.2 IC1.28
PC7
  Bottom 0.4: R7.2 IC1.29
PD0
  Bottom 0.4: IC1.14 57.15,19.05 63.5,12.7 J2.1
PD1
  Bottom 0.4: IC1.15 59.69,19.05 66.04,12.7 J2.2
PD2
  Bottom 0.4: IC1.16 62.23,19.05 68.58,12.7 J2.3
PD3
  Bottom 0.4: IC1.17 64.77,19.05 71.12,12.7 J2.4
PD4
  Bottom 0.4: IC1.18 67.31,19.05 73.66,12.7 J2.5
PD5
  Bottom 0.4: IC1.19 69.85,19.05 76.2,12.7 J2.6
PD6
  Bottom 0.4: IC1.20 72.39,19.05 78.74,12.7 J2.7
PD7
  Bottom 0.4: IC1.21 72.39,27.94 74.3,26.03 74.3,19.68 81.28,12.7 J2.8
RST
  Bottom 0.4: IC1.9 44.45,17.78 43.18,16.51 J1.4 43.18,5.08 44.45,3.81 51.79,3.81 S1.1 52.35,5.36 53.34,6.35 57.78,6.35 59.69,4.44 R1.1
SCK
  Bottom 0.4: IC1.8 41.91,17.78 40.64,16.51 J1.3
VCC
  Bottom 0.5: IC2.4 98.28,34.14 95.88,31.75 R3.2 | R2.E 11.43,53.34 13.72,51.05 LCD.2 16,50.8 44.46,50.8 LCD.15 46.74,45.97 49.53,43.18 IC1.30 49.53,37.47 47.62,35.56 47.62,31.75 46.99,31.11 IC1.10 46.99,17.78 45.72,16.51 J1.5 47.62,9.52 50.16,9.52 50.8,8.89 57.15,8.89 R1.2 59.69,8.25 63.5,4.44 83.82,4.44 86.36,6.98 86.36,17.14 82.55,20.95 79.38,20.95 76.83,23.49 76.83,27.94 79.38,30.48 84.58,30.48 C3.+ 85.85,31.24 86.99,32.38 | R3.2 C4.1 | IC3.8 76.2,60.96 74.93,59.69 R9.2 R8.2 74.93,38.1 78.1,34.92 84.45,34.92 85.41,33.97 | 85.41,33.97 86.99,32.38 | 86.99,32.38 87.63,31.75 R3.2 | L1.2 85.41,34.15 85.41,33.97